# Altium project BMS_Current_Sense.PrjPcb
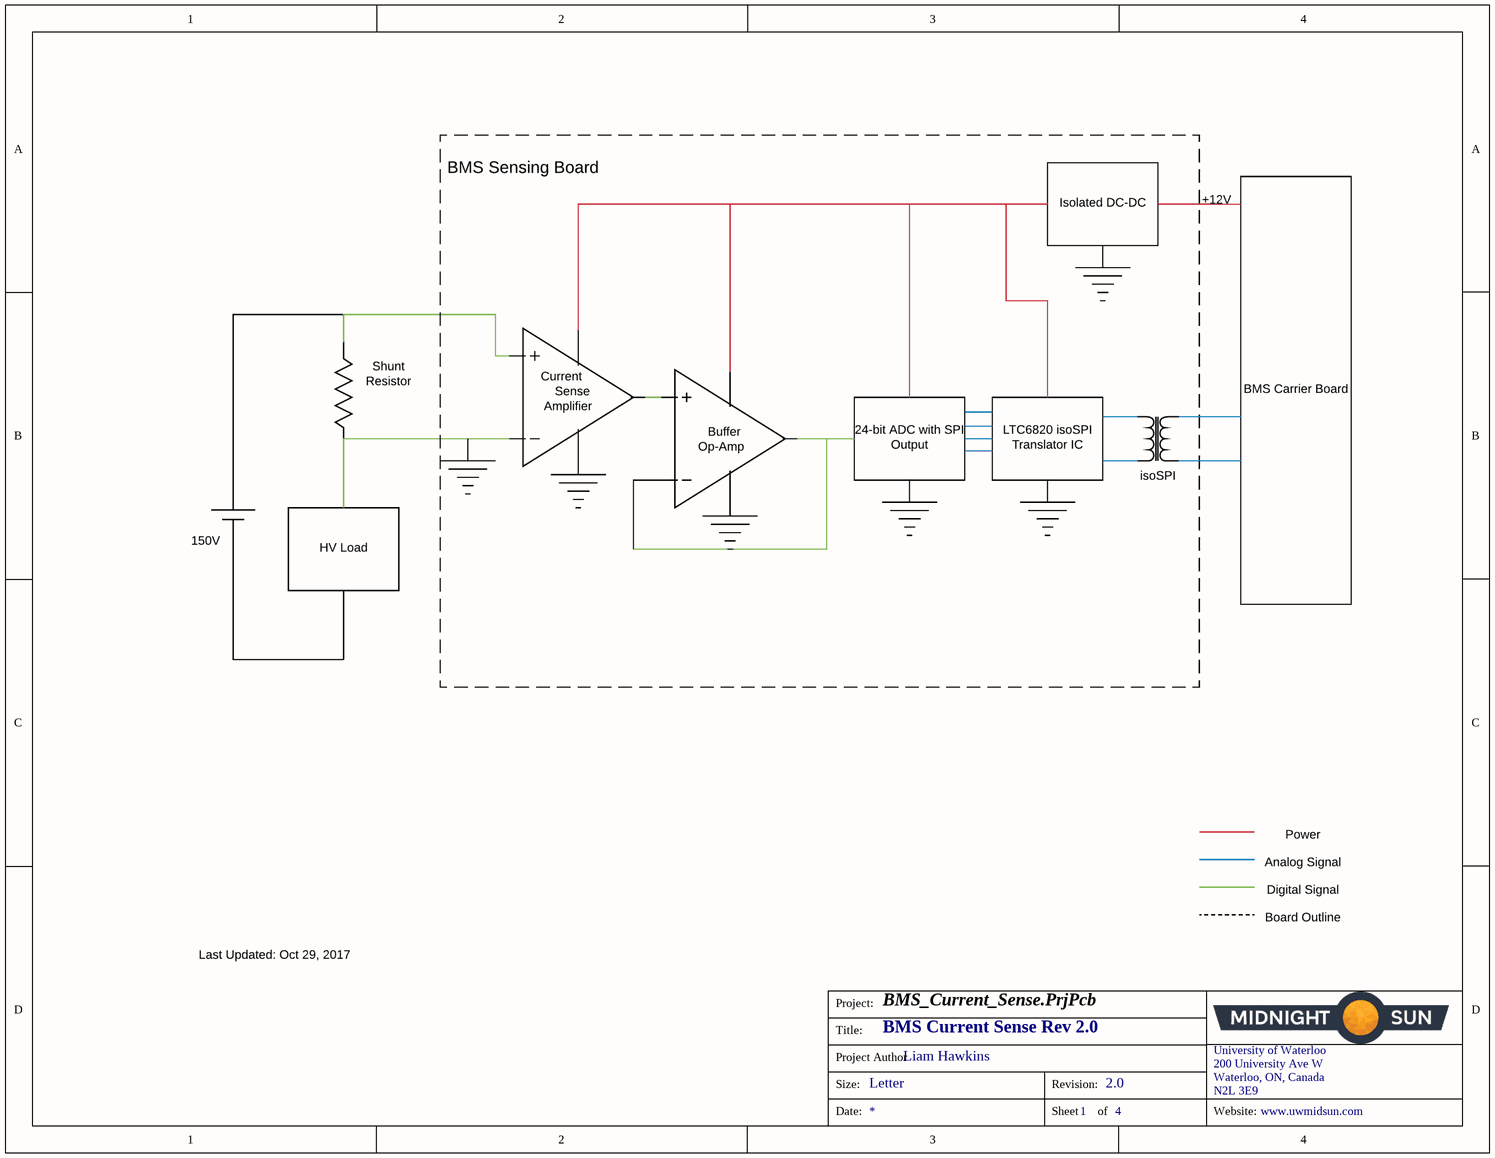
[diagram p0: Block Diagram.SchDoc]
Title: BMS Current Sense Rev 2.0; ProjectRevision: 2.0; ProjectAuthor: Liam Hawkins
4 sheets, 57 parts. Net scope: flat (ports and power ports of the same name join across sheets).
Board file: BMS_Current_Sense.PcbDoc
Sheets:
  Block Diagram.SchDoc
  BMS_Current_Sense.SchDoc
  isoSPI_Interface.SchDoc
  ADC_Circuit.SchDoc

## Sheet Block Diagram.SchDoc: BMS Current Sense Rev 2.0
size Letter; Organization: Midnight Sun Solar Rayce Car Team; Address1: University of Waterloo; Address2: 200 University Ave W; Address3: Waterloo, ON, Canada; Address4: N2L 3E9; DocumentNumber: 1; SheetNumber: 1; SheetTotal: 4; Website: www.uwmidsun.com

### Notes on the sheet
- Project:
- Title:
- Size:
- Project Author
- Letter
- Revision:
- University of Waterloo
- 200 University Ave W
- Waterloo, ON, Canada
- N2L 3E9
- Date:
- Sheet
- of
- Website:

## Sheet BMS_Current_Sense.SchDoc: BMS Current Sense Rev 2.0
size Letter; Organization: Midnight Sun Solar Rayce Car Team; Address1: University of Waterloo; Address2: 200 University Ave W; Address3: Waterloo, ON, Canada; Address4: N2L 3E9; DocumentNumber: 2; SheetNumber: 2; SheetTotal: 4; Website: www.uwmidsun.com
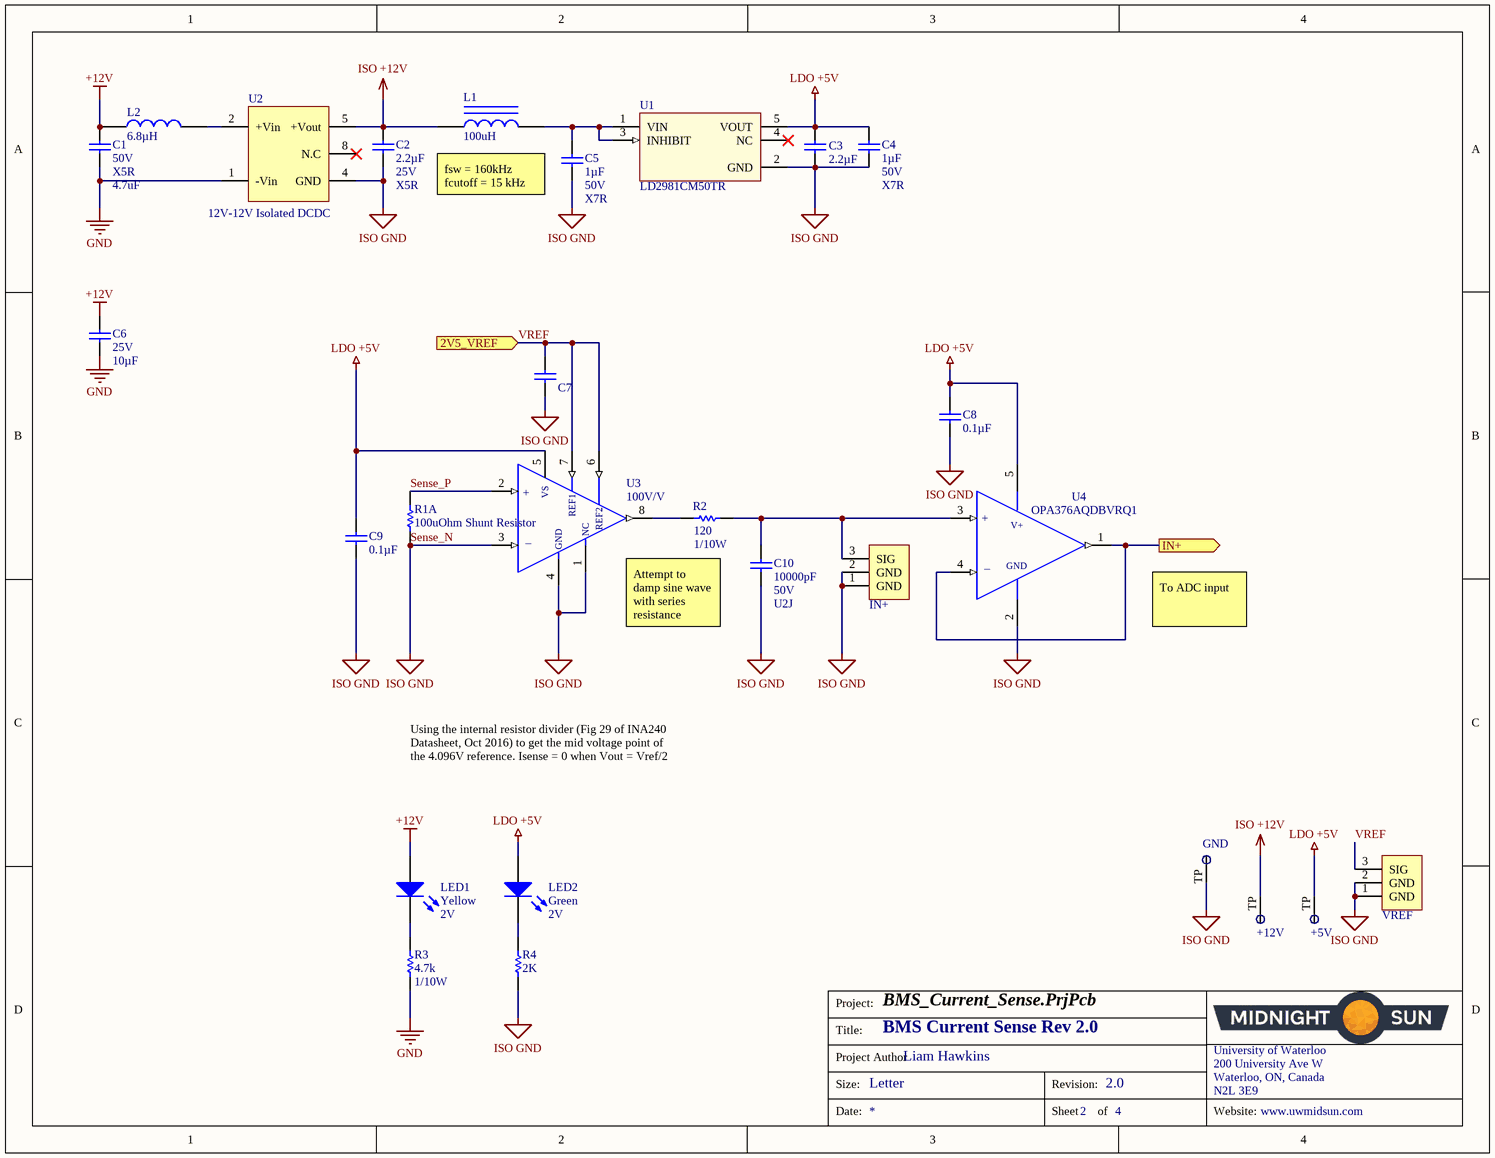
[diagram p1: BMS_Current_Sense.SchDoc]

### Parts
+5V  Test Point  [Test Point]  (value not drawn)  (no BOM)
+12V  Test Point  [Test Point]  (value not drawn)  (no BOM)
C1  value 4.7uF  Voltage - Rated: 50V  Temperature Coefficient: X5R  [CAP, 0805]  (hidden comment: CAP CER 4.7UF 50V 10% X5R 0805)
C2  Capacitance: 2.2µF  Voltage: 25V  Temperature Coefficient: X5R  [CAP, 0603]  (hidden comment: CAP CER 2.2UF 25V 10% X5R 0603)
C3  Capacitance: 2.2µF  [CAP, 0603]  (hidden comment: CAP CER 2.2UF 25V 10% X5R 0603)
C4  Capacitance: 1µF  Voltage: 50V  Temperature Coefficient: X7R  [CAP, 0603]  (hidden comment: CAP CER 1UF 50V 10% X7R 0603)
C5  Capacitance: 1µF  Voltage: 50V  Temperature Coefficient: X7R  [CAP, 0603]  (hidden comment: CAP CER 1UF 50V 10% X7R 0603)
C6  Voltage - Rated: 25V  Capacitance: 10µF  [CAP, 0805]  (hidden comment: CAP CER 10uF 25V 10% X5R 0805)
C7  CAP CER 0.022UF 50V 10% X7R 0603  [CAP, 0603]  (value not drawn)
C8  Capacitance: 0.1µF  [CAP, 0603]  (hidden comment: CAP CER 0.1UF 50V 10% X7R 0603)
C9  Capacitance: 0.1µF  [CAP, 0603]  (hidden comment: CAP CER 0.1UF 50V 10% X7R 0603)
C10  Capacitance: 10000pF  Voltage: 50V  Temperature Coefficient: U2J  [CAP, 0603]  (hidden comment: CAP CER 10nF 50V 5% X7R 0603)
GND  Test Point  [Test Point]  (value not drawn)  (no BOM)
IN+  U.FL-R-SMT-1(01)  [CONN U.FL RCPT STR 50 OHM SMD]  (value not drawn)
L1  value 100uH  [1210]  (hidden comment: IND 100uH 60mA 5% 1210)
L2  Inductance: 6.8µH  [NLFV32T-6R8M-EF/IND 6.8uH]  (hidden comment: IND 6.8uH 260mA 20% 1210)
LED1  Color: Yellow  Voltage - Forward (Vf) (Typ): 2V  [LED_0603]  (hidden comment: LED YELLOW CLEAR 2.1V 0603)
LED2  Color: Green  Voltage - Forward (Vf) (Typ): 2V  [LED_0603]  (hidden comment: LED GREEN CLEAR 2V 0603)
R1  100uOhm Shunt Resistor  [RES SHUNT 100UOHM 60MM]  (part A of 2)
R2  Resistance: 120  Power: 1/10W  [RES, 0603]  (hidden comment: RES 120 OHM 1% 1/10W 0603)
R3  Resistance (Ohms): 4.7k  Power (Watts): 1/10W  [RES, 0603]  (hidden comment: RES 4.7K OHM 1% 1/10W 0603)
R4  2K  [RES, 0603]
U1  Manufacturer Part Number 1: LD2981CM50TR  [SOT95P280X145-5N]  (hidden comment: IC REG LDO 5V 0.1A SOT23-5)
U2  Type: 12V-12V Isolated DCDC  [IC, Isolated DCDC]  (hidden comment: IC DCDC ISOLATED 12V 1W 8-SMD 5-LEAD)
U3  100V/V  [IC CURRENT AMPLIFIER INA240 TSSOP-8]
U4  Manufacturer Part Number: OPA376AQDBVRQ1  [IC OP AMP GP RR 10MHZ SOT-23-5]  (hidden comment: IC OP AMP GEN PURPOSE RR 5.5MHZ SOT-23-5)
VREF  U.FL-R-SMT-1(01)  [CONN U.FL RCPT STR 50 OHM SMD]  (value not drawn)

### Ports
2V5_VREF (in), IN+ (out)

### Nets
+12V: C1.1 C6.1 L2.1 LED1.1(A)
GND: C1.2 C6.2 R3.2 U2.1(-Vin)
ISO +12V: +12V.TP C2.1 L1.1 U2.5(+Vout)
LDO +5V: +5V.TP C3.1 C4.1 C8.1 C9.1 LED2.1(A) U1.5(VOUT) U3.5(VS) U4.5(VDD)
Sense_N: C2.2 C3.2 C4.2 C5.2 C7.2 C8.2 C9.2 C10.2 GND.TP IN+.1(GND) IN+.2(GND) R1.6 R4.2 U1.2(GND) U2.4(GND) U3.1(NC) U3.3(-IN) U3.4(GND) U4.2(VSS) VREF.1(GND) VREF.2(GND)  [also labelled ISO GND]
Sense_P: R1.5 U3.2(+IN)  [project net Sense_P_2]
VREF: C7.1 U3.6(REF2) U3.7(REF1) VREF.3(SIG) ; port 2V5_VREF
NetC5_1: C5.1 L1.2 U1.1(VIN) U1.3(INHIBIT)
NetC10_1: C10.1 IN+.3(SIG) R2.2 U4.3(+IN)
NetL2_2: L2.2 U2.2(+Vin)
NetLED1_2: LED1.2(K) R3.1
NetLED2_2: LED2.2(K) R4.1
NetR2_1: R2.1 U3.8(OUTPUT)
NetR11_1: U4.1(OUTPUT) U4.4(-IN) ; port IN+

Not connected (* = marked no-connect by the designer): U1 4(NC)*; U2 8(N.C)*

### Notes on the sheet
- fsw = 160kHz
  fcutoff = 15 kHz
- (near U3) Attempt to damp sine wave with series resistance
- To ADC input
- Using the internal resistor divider (Fig 29 of INA240 Datasheet, Oct 2016) to get the mid voltage point of the 4.096V reference. Isense = 0 when Vout = Vref/2
- Project:
- Title:
- Size:
- Project Author
- Letter
- Revision:
- University of Waterloo
- 200 University Ave W
- Waterloo, ON, Canada
- N2L 3E9
- Date:
- Sheet
- of
- Website:
- (in symbol IC CURRENT AMPLIFIER INA240 8-TSSOP) +; _
- (in symbol IC OP AMP GEN PURPOSE RR 5.5MHZ SOT-23-5) +; V+; GND; _

### Library data of the parts
C1 = CAP CER 4.7UF 50V 10% X5R 0805: 4.7µF ±20% 50V Ceramic Capacitor X5R 0805 (2012 Metric); Manufacturer 1: Murata Electronics North America; Manufacturer Part Number 1: GRT21BR61H475ME13L; Description 1: CAP CER 4.7UF 50V X5R 0805; Supplier 1: Digi-Key; Supplier Part Number 1: 490-12395-1-ND; RoHS: RoHS Compliant; Category: Capacitors; Stock 1: 4286; Pricing 1: 1=0.56, 10=0.389, 100=0.2338, 500=0.17536, 1000=0.14808 (CAD); Packaging: Cut Tape (CT); Part Status: Active; Tolerance: ±20%; Operating Temperature: -55°C ~ 85°C; Features: -; Ratings: AEC-Q200; Applications: Automotive; Mounting Type: Surface Mount, MLCC; Package / Case: 0805 (2012 Metric); Size / Dimension: 0.079" L x 0.049" W (2.00mm x 1.25mm); Height - Seated (Max): -; Thickness (Max): 0.057" (1.45mm); Lead Spacing: -; Lead Style: -; ComponentLink1URL: http://search.murata.co.jp/Ceramy/image/img/A01X/G101/ENG/GRT21BR61H475ME13-01.pdf; ComponentLink1Description: http://search.murata.co.jp/Ceramy/image/img/A01X/G101/ENG/GRT21BR61H475ME13-01.pdf
C2 C3 = CAP CER 2.2UF 25V 10% X5R 0603: 2.2µF ±10% 25V Ceramic Capacitor X5R 0603 (1608 Metric); Manufacturer 1: Murata Electronics North America; Manufacturer Part Number 1: GRM188R61E225KA12D; Supplier 1: Digi-Key; Supplier Part Number 1: 490-10731-1-ND; Packaging: Cut Tape (CT); Part Status: Active; Operating Temperature: -55°C ~ 85°C; Ratings: -; Mounting Type: Surface Mount, MLCC; Package / Case: 0603 (1608 Metric); Size / Dimension: 0.063" L x 0.031" W (1.60mm x 0.80mm); Height - Seated (Max): -; Thickness (Max): 0.035" (0.90mm); Lead Spacing: -; Lead Style: -; ComponentLink1URL: http://www.murata.com/~/media/webrenewal/support/library/catalog/products/capacitor/mlcc/c02e.ashx; ComponentLink1Description: http://www.murata.com/~/media/webrenewal/support/library/catalog/products/capacitor/mlcc/c02e.ashx; Tolerance: ±10%
  C3: Voltage: 25V; Temperature Coefficient: X5R
C4 C5 = CAP CER 1UF 50V 10% X7R 0603: 1µF ±10% 50V Ceramic Capacitor X7R 0603 (1608 Metric); Manufacturer 1: Taiyo Yuden; Manufacturer Part Number 1: UMK107AB7105KA-T; Supplier 1: Digi-Key; Supplier Part Number 1: 587-3247-1-ND; Packaging: Cut Tape (CT); Part Status: Active; Operating Temperature: -55°C ~ 125°C; Ratings: -; Mounting Type: Surface Mount, MLCC; Package / Case: 0603 (1608 Metric); Size / Dimension: 0.063" L x 0.031" W (1.60mm x 0.80mm); Height - Seated (Max): -; Thickness (Max): 0.037" (0.95mm); Lead Spacing: -; Lead Style: -; ComponentLink1URL: http://www.yuden.co.jp/productdata/catalog/en/mlcc_all_e.pdf; ComponentLink1Description: http://www.yuden.co.jp/productdata/catalog/en/mlcc_all_e.pdf; Tolerance: ±10%
C6 = CAP CER 10uF 25V 10% X5R 0805: 10µF ±10% 25V Ceramic Capacitor X5R 0805 (2012 Metric); Manufacturer: Murata Electronics North America; Manufacturer Part Number: GRM21BR61E106KA73L; Supplier 1: Digi-Key; RoHS: RoHS Compliant; Category: Capacitors; Stock 1: 1695157; Packaging: Cut Tape (CT); Part Status: Active; Tolerance: ±10%; Temperature Coefficient: X5R; Operating Temperature: -55°C ~ 85°C; Features: -; Ratings: -; Applications: General Purpose; Mounting Type: Surface Mount, MLCC; Package / Case: 0805 (2012 Metric); Size / Dimension: 0.079" L x 0.049" W (2.00mm x 1.25mm); Height - Seated (Max): -; Thickness (Max): 0.053" (1.35mm); Lead Spacing: -; Lead Style: -; ComponentLink1URL: http://search.murata.co.jp/Ceramy/image/img/A01X/G101/ENG/GRM21BR61E106KA73-01.pdf; ComponentLink1Description: http://search.murata.co.jp/Ceramy/image/img/A01X/G101/ENG/GRM21BR61E106KA73-01.pdf; Supplier Part Number 1: 490-5523-1-ND; Pricing 1: 1=0.3, 10=0.214, 100=0.1008, 500=0.07068, 1000=0.05851 (CAD)
C7 = CAP CER 0.022UF 50V 10% X7R 0603: 0.022µF ±10% 50V Ceramic Capacitor X7R 0603 (1608 Metric); Manufacturer 1: Murata Electronics North America; Manufacturer Part Number 1: GRM188R71H223KA01D; Description 1: CAP CER 0.022UF 50V X7R 0603; Supplier 1: Digi-Key; Supplier Part Number 1: 490-1517-1-ND; RoHS: RoHS Compliant; Category: Capacitors; Stock 1: 612330; Pricing 1: 1=0.15, 10=0.111, 100=0.0499, 500=0.03564, 1000=0.02801 (CAD); Packaging: Cut Tape (CT); Part Status: Active; Tolerance: ±10%; Voltage - Rated: 50V; Temperature Coefficient: X7R; Operating Temperature: -55°C ~ 125°C; Features: -; Ratings: -; Applications: General Purpose; Mounting Type: Surface Mount, MLCC; Package / Case: 0603 (1608 Metric); Size / Dimension: 0.063" L x 0.032" W (1.60mm x 0.80mm); Height - Seated (Max): -; Thickness (Max): 0.035" (0.90mm); Lead Spacing: -; Lead Style: -; ComponentLink1URL: http://search.murata.co.jp/Ceramy/image/img/A01X/G101/ENG/GRM188R71H223KA01-01.pdf; ComponentLink1Description: http://search.murata.co.jp/Ceramy/image/img/A01X/G101/ENG/GRM188R71H223KA01-01.pdf
C8 C9 = CAP CER 0.1UF 50V 10% X7R 0603: 0.10µF ±10% 50V Ceramic Capacitor X7R 0603 (1608 Metric); Manufacturer 1: AVX Corporation; Manufacturer Part Number 1: 06035C104KAT2A; Supplier 1: Digi-Key; Supplier Part Number 1: 478-5052-1-ND; Packaging: Cut Tape (CT); Part Status: Active; Operating Temperature: -55°C ~ 125°C; Ratings: -; Mounting Type: Surface Mount, MLCC; Package / Case: 0603 (1608 Metric); Size / Dimension: 0.063" L x 0.032" W (1.60mm x 0.81mm); Height - Seated (Max): -; Thickness (Max): 0.035" (0.90mm); Lead Spacing: -; Lead Style: -; ComponentLink1URL: http://datasheets.avx.com/X7RDielectric.pdf; ComponentLink1Description: http://datasheets.avx.com/X7RDielectric.pdf; Tolerance: ±10%; Voltage: 50V; Temperature Coefficient: X7R
C10 = CAP CER 10nF 50V 5% X7R 0603: 10000pF ±5% 50V Ceramic Capacitor U2J 0603 (1608 Metric); Manufacturer 1: KEMET; Manufacturer Part Number 1: C0603C103J5JAC7867; Supplier 1: Digi-Key; Supplier Part Number 1: 399-13384-1-ND; Packaging: Cut Tape (CT); Part Status: Active; Operating Temperature: -55°C ~ 125°C; Ratings: -; Failure Rate: -; Mounting Type: Surface Mount, MLCC; Package / Case: 0603 (1608 Metric); Size / Dimension: 0.063" L x 0.032" W (1.60mm x 0.80mm); Height - Seated (Max): -; Thickness (Max): 0.034" (0.87mm); Lead Spacing: -; Lead Style: -; ComponentLink1URL: http://www.kemet.com/docfinder?Partnumber=C0603C103J5JAC7867; ComponentLink1Description: http://www.kemet.com/docfinder?Partnumber=C0603C103J5JAC7867; Tolerance: ±5%
IN+ VREF = CONN U.FL RCPT STR 50 OHM SMD: U.FL (UMCC) Connector Receptacle, Male Pin 50Ohm Surface Mount Solder; Manufacturer: Hirose; Body Material: Bronze; Body Plating: Silver; Dielectric Material: Polymer; Max Frequency: 6GHz; Connector Type: Male Pin,Receptacle; Impedance: 50R; Supplier 1: Digi-Key; Manufacturer Part Number: U.FL-R-SMT-1(01); RoHS: Yes; Category: RF / Coaxial Connectors; Stock 1: 1274; Pricing 1: 1=1.28000, 10=1.12200, 25=1.05600, 50=1.01200, 100=0.96800, 250=0.88000, 500=0.79200, 1000=0.70400, 2500=0.63800 (USD); Mount: Surface Mount; Housing Color: Silver; Contact Plating: Gold; Contact Material: Bronze,Brass; Min Operating Temperature: -40°C; Max Operating Temperature: 90°C; Termination: Solder; Orientation: Vertical; Package Quantity: 100; Packaging: Bulk; Fastening Type: Snap; Length: 3.1mm; Depth: 3mm; Radiation Hardening: No; Lead Free: Lead Free; ComponentLink1URL: https://datasheet.ciiva.com/26945/getdatasheetpartid-475239-26945414.pdf?src-supplier=Verical; ComponentLink1Description: https://datasheet.ciiva.com/26945/getdatasheetpartid-475239-26945414.pdf?src-supplier=Verical; Supplier Part Number 1: H122041-ND
L1 = IND 100uH 60mA 5% 1210: 100µH Unshielded Wirewound Inductor 60mA 11 Ohm Max 1210 (3225 Metric); Manufacturer: EPCOS (TDK); Manufacturer Part Number: B82422T1104J000; Material - Core: Ferrite; Q @ Freq: 20 @ 796kHz; Supplier 1: Digi-Key; RoHS: RoHS Compliant; Category: Inductors, Coils, Chokes; Stock 1: 4846; Pricing 1: 1=0.65, 10=0.568, 100=0.4062, 500=0.3412, 1000=0.27621 (CAD); Packaging: Cut Tape (CT); Part Status: Active; Type: Wirewound; Tolerance: ±5%; Shielding: Unshielded; DC Resistance (DCR): 11 Ohm Max; Ratings: AEC-Q200; Operating Temperature: -55°C ~ 125°C; Mounting Type: Surface Mount; Package / Case: 1210 (3225 Metric); Supplier Device Package: 1210 (3225 Metric); Size / Dimension: 0.126" L x 0.098" W (3.20mm x 2.50mm); Height - Seated (Max): 0.083" (2.10mm); ComponentLink1URL: https://en.tdk.eu/inf/30/db/ind_2008/b82422t.pdf; ComponentLink1Description: https://en.tdk.eu/inf/30/db/ind_2008/b82422t.pdf; Supplier Part Number 1: 495-5646-1-ND
L2 = IND 6.8uH 260mA 20% 1210: 6.8µH Shielded Wirewound Inductor 260mA 204 mOhm Max 1210 (3225 Metric); Manufacturer 1: TDK Corporation; Manufacturer Part Number 1: NLFV32T-6R8M-EF; Material - Core: Ferrite; Supplier 1: Digi-Key; Supplier Part Number 1: 445-15776-1-ND; Packaging: Cut Tape (CT); Part Status: Active; Type: Wirewound; Current Rating: 260mA; Current - Saturation: -; Shielding: Shielded; DC Resistance (DCR): 204 mOhm Max; Q @ Freq: -; Frequency - Self Resonant: -; Ratings: -; Operating Temperature: -40°C ~ 105°C; Mounting Type: Surface Mount; Package / Case: 1210 (3225 Metric); Supplier Device Package: 1210 (3225 Metric); Size / Dimension: 0.126" L x 0.098" W (3.20mm x 2.50mm); Height - Seated (Max): 0.094" (2.40mm); ComponentLink1URL: https://product.tdk.com/info/en/catalog/datasheets/inductor_commercial_decoupling_nlfv32-ef_en.pdf; ComponentLink1Description: https://product.tdk.com/info/en/catalog/datasheets/inductor_commercial_decoupling_nlfv32-ef_en.pdf; Tolerance: ±20%
LED1 = LED YELLOW CLEAR 2.1V 0603: Yellow 590nm LED Indication - Discrete 2V 0603 (1608 Metric); Manufacturer: Wurth Electronics Inc.; Manufacturer Part Number: 150060YS75000; Lens Color: Colorless; Millicandela Rating: 120mcd; Lens Style/Size: Rectangle with Flat Top, 1.10mm x 0.70mm; Current - Test: 20mA; Viewing Angle: 140°; Wavelength - Peak: 595nm; Supplier 1: Digi-Key; RoHS: RoHS Compliant; Category: Optoelectronics; Stock 1: 10523; Pricing 1: 1=0.21, 100=0.1617, 500=0.13964 (CAD); Packaging: Cut Tape (CT); Part Status: Active; Lens Transparency: Clear; Mounting Type: Surface Mount; Wavelength - Dominant: 590nm; Features: -; Package / Case: 0603 (1608 Metric); Supplier Device Package: 0603; Size / Dimension: 1.60mm L x 0.80mm W; Height (Max): 0.80mm; ComponentLink1URL: http://katalog.we-online.de/led/datasheet/150060YS75000.pdf; ComponentLink1Description: http://katalog.we-online.de/led/datasheet/150060YS75000.pdf; Supplier Part Number 1: 732-4981-1-ND
LED2 = LED GREEN CLEAR 2V 0603: Green 572nm LED Indication - Discrete 2V 0603 (1608 Metric); Manufacturer: Wurth Electronics Inc.; Manufacturer Part Number: 150060VS75000; Lens Color: Colorless; Millicandela Rating: 40mcd; Lens Style/Size: Rectangle with Flat Top, 1.10mm x 0.70mm; Current - Test: 20mA; Viewing Angle: 140°; Wavelength - Dominant: 570nm; Supplier 1: Digi-Key; RoHS: RoHS Compliant; Category: Optoelectronics; Stock 1: 9408; Pricing 1: 1=0.21, 100=0.1617, 500=0.13964 (CAD); Packaging: Cut Tape (CT); Part Status: Active; Lens Transparency: Clear; Mounting Type: Surface Mount; Wavelength - Peak: 572nm; Features: -; Package / Case: 0603 (1608 Metric); Supplier Device Package: 0603; Size / Dimension: 1.60mm L x 0.80mm W; Height (Max): 0.80mm; ComponentLink1URL: http://katalog.we-online.de/led/datasheet/150060VS75000.pdf; ComponentLink1Description: http://katalog.we-online.de/led/datasheet/150060VS75000.pdf; Supplier Part Number 1: 732-4980-1-ND
R1 = RES SHUNT 100UOHM 5% 36W 60MM: 100 µOhms ±5% 36W Shunt, Battery Specialized Resistor Metal Element ±175ppm/°C Shunt Fixture, 60mm Pitch; Manufacturer 1: Vishay Dale; Manufacturer Part Number 1: WSBM8518L1000JK; Supplier 1: Digi-Key; Supplier Part Number 1: 541-1906-ND; RoHS: RoHS Compliant; Description 1: RES SHUNT 100 UOHM 5% 36W; Category: Resistors; Stock 1: 0; Pricing 1: 1=16.24, 10=14.764, 25=13.2876, 50=11.442, 100=10.5192, 250=9.9656, 500=9.5965, 1000=9.15359 (CAD); Packaging: Bulk; Part Status: Active; Type: Shunt, Battery; Applications: -; Composition: Metal Element; Tolerance: ±5%; Power (Watts): 36W; Temperature Coefficient: ±175ppm/°C; Operating Temperature: -65°C ~ 170°C; Mounting Type: Shunt Fixture, 60mm Pitch; ComponentLink1URL: http://www.vishay.com/docs/31094/wsbm8518.pdf; ComponentLink1Description: http://www.vishay.com/docs/31094/wsbm8518.pdf
R2 = RES 120 OHM 1% 1/10W 0603: RES SMD 120 OHM 1% 1/10W 0603; Manufacturer 1: Yageo; Manufacturer Part Number 1: RC0603FR-07120RL; Temperature Coefficient: ±100ppm/°C; Supplier 1: Digi-Key; Supplier Part Number 1: 311-120HRCT-ND; Packaging: Cut Tape (CT); Part Status: Active; Composition: Thick Film; Operating Temperature: -55°C ~ 155°C; Package / Case: 0603 (1608 Metric); Supplier Device Package: 0603; Size / Dimension: 0.063" L x 0.031" W (1.60mm x 0.80mm); Height - Seated (Max): 0.022" (0.55mm); Failure Rate: -; ComponentLink1URL: http://www.yageo.com/documents/recent/PYu-RC_Group_51_RoHS_L_7.pdf; ComponentLink1Description: http://www.yageo.com/documents/recent/PYu-RC_Group_51_RoHS_L_7.pdf; Tolerance: ±1%
R3 = RES 4.7K OHM 1% 1/10W 0603: 4.7k Ohm ±1% 0.1W, 1/10W Chip Resistor 0603 (1608 Metric) Moisture Resistant Thick Film; Manufacturer 1: Yageo; Manufacturer Part Number 1: RC0603FR-074K7L; Description 1: RES SMD 4.7K OHM 1% 1/10W 0603; Temperature Coefficient: ±100ppm/°C; Supplier 1: Digi-Key; Supplier Part Number 1: 311-4.70KHRCT-ND; RoHS: RoHS Compliant; Category: Resistors; Stock 1: 3487566; Pricing 1: 1=0.16, 10=0.022, 100=0.0089, 1000=0.00402, 2500=0.00349 (CAD); Packaging: Cut Tape (CT); Part Status: Active; Composition: Thick Film; Features: Moisture Resistant; Operating Temperature: -55°C ~ 155°C; Package / Case: 0603 (1608 Metric); Supplier Device Package: 0603; Size / Dimension: 0.063" L x 0.031" W (1.60mm x 0.80mm); Height - Seated (Max): 0.022" (0.55mm); Failure Rate: -; ComponentLink1URL: http://www.yageo.com/documents/recent/PYu-RC_Group_51_RoHS_L_7.pdf; ComponentLink1Description: http://www.yageo.com/documents/recent/PYu-RC_Group_51_RoHS_L_7.pdf; Tolerance: ±1%
R4 = RES 2K OHM 1% 1/10W 0603: 2k Ohm ±1% 0.1W, 1/10W Chip Resistor 0603 (1608 Metric) Moisture Resistant Thick Film; Manufacturer: Yageo; Manufacturer Part Number: RC0603FR-072KL; Temperature Coefficient: ±100ppm/°C; Supplier 1: Digi-Key; RoHS: RoHS Compliant; Category: Resistors; Stock 1: 1750701; Pricing 1: 1=0.15, 10=0.023, 100=0.0093, 1000=0.00415, 2500=0.0036 (CAD); Packaging: Cut Tape (CT); Part Status: Active; Resistance (Ohms): 2k; Tolerance: ±1%; Power (Watts): 0.1W, 1/10W; Composition: Thick Film; Features: Moisture Resistant; Operating Temperature: -55°C ~ 155°C; Package / Case: 0603 (1608 Metric); Supplier Device Package: 0603; Size / Dimension: 0.063" L x 0.031" W (1.60mm x 0.80mm); Height - Seated (Max): 0.022" (0.55mm); Failure Rate: -; ComponentLink1URL: http://www.yageo.com/documents/recent/PYu-RC_Group_51_RoHS_L_7.pdf; ComponentLink1Description: http://www.yageo.com/documents/recent/PYu-RC_Group_51_RoHS_L_7.pdf; Supplier Part Number 1: 311-2.00KHRCT-ND
U1 = IC REG LDO 5V 0.1A SOT23-5: Linear Voltage Regulator IC Positive Fixed Output 5V 100mA SOT-23-5; Manufacturer 1: STMicroelectronics; Voltage - Dropout (Typical): 0.18V @ 100mA; Voltage - Input: Up to 16V; Supplier 1: Digi-Key; Supplier Part Number 1: 497-7787-1-ND; Packaging: Cut Tape (CT); Part Status: Active; Regulator Topology: Positive Fixed; Voltage - Output: 5V; Current - Output: 100mA; Current - Limit (Min): -; Operating Temperature: -40°C ~ 125°C; Mounting Type: Surface Mount; Package / Case: SC-74A, SOT-753; Supplier Device Package: SOT-23-5; ComponentLink1URL: http://www.st.com/content/ccc/resource/technical/document/datasheet/group1/b7/b5/a1/83/9c/bd/4a/90/CD00001635/files/CD00001635.pdf/jcr:content/translations/en.CD00001635.pdf; ComponentLink1Description: http://www.st.com/content/ccc/resource/technical/document/datasheet/group1/b7/b5/a1/83/9c/bd/4a/90/CD00001635/files/CD00001635.pdf/jcr:content/translations/en.CD00001635.pdf
U2 = IC DCDC ISOLATED 12V 1W 8-SMD 5-LEAD: Isolated Module DC DC Converter 1 Output 12V 84mA 10.8V - 13.2V Input; Manufacturer 1: XP Power; Manufacturer Part Number 1: ISE1212A; Number of Outputs: 1; Voltage - Isolation: 1.5kV (1500V); Efficiency: 81%; Supplier 1: Digi-Key; Supplier Part Number 1: 1470-2950-1-ND; Packaging: Cut Tape (CT); Part Status: Active; Voltage - Input (Min): 10.8V; Voltage - Input (Max): 13.2V; Voltage - Output 1: 12V; Voltage - Output 2: -; Voltage - Output 3: -; Current - Output (Max): 84mA; Operating Temperature: -40°C ~ 105°C; Mounting Type: Surface Mount; Package / Case: 8-SMD Module, 5 Leads; Size / Dimension: 0.50" L x 0.44" W x 0.29" H (12.7mm x 11.2mm x 7.3mm); ComponentLink1URL: http://www.xppower.com/Portals/0/pdfs/SF_ISE.pdf; ComponentLink1Description: http://www.xppower.com/Portals/0/pdfs/SF_ISE.pdf; Power: 1W
U3 = IC CURRENT AMPLIFIER INA240 8-TSSOP: Current Sense Amplifier 1 Circuit 8-TSSOP; Manufacturer 1: Texas Instruments; Manufacturer Part Number 1: INA240A3PWR; Description 1: IC AMP CURRENT SENSE 8-TSSOP; Slew Rate: 2 V/µs; Current - Supply: 1.8mA; Voltage - Supply, Single/Dual (±): 2.7 V ~ 5.5 V; Supplier 1: Digi-Key; Supplier Part Number 1: 296-45090-1-ND; RoHS: RoHS Compliant; Category: Integrated Circuits (ICs); Stock 1: 1286; Pricing 1: 1=3.79, 10=3.397, 100=2.7311, 500=2.24388, 1000=1.85921 (CAD); Packaging: Cut Tape (CT); Part Status: Active; Amplifier Type: Current Sense; Output Type: -; Operating Temperature: -40°C ~ 125°C; Mounting Type: Surface Mount; Package / Case: 8-TSSOP (0.173", 4.40mm Width); Supplier Device Package: 8-TSSOP; ComponentLink1URL: http://www.ti.com/lit/ds/symlink/ina240.pdf; ComponentLink1Description: http://www.ti.com/lit/ds/symlink/ina240.pdf
U4 = IC OP AMP GEN PURPOSE RR 5.5MHZ SOT-23-5: General Purpose Amplifier 1 Circuit Rail-to-Rail SOT-23-5; Manufacturer: Texas Instruments; Max Supply Voltage: 5.5V; Min Supply Voltage: 2.2V; Output Current: 30mA; Nominal Supply Current: 950uA; Voltage Gain: 134dB; Common Mode Rejection Ratio: 76dB; Number of Channels: 1; Slew Rate: 2V/µs; Max I/O Voltage: 25uV; Input Bias Current: 10pA; Operating Supply Current: 760uA; Output Current per Channel: 50mA; Power Supply Rejection Ratio (PSRR): 106.02dB; Supplier 1: Digi-Key; Stock 1: 26635; Pricing 1: 1 = 2.14000, 10 = 1.92200, 100 = 1.54450, 500 = 1.26896, 1000 = 1.05142 (USD); RoHS: Yes; Case/Package: SOT-23-5; Number of Pins: 5; Min Operating Temperature: -40°C; Max Operating Temperature: 125°C; Unity Gain Bandwidth Product: 5.5MHz; Packaging: Tape and Reel; Package Quantity: 3000; Number of Circuits: 1; Gain Bandwidth Product: 5.5MHz; Input Offset Voltage (Vos): 25uV; Number of Elements: 1; Radiation Hardening: No; Lead Free: Lead Free; ComponentLink1URL: http://www.ti.com/lit/ds/sbos549/sbos549.pdf?src-supplier=Avnet; ComponentLink1Description: http://www.ti.com/lit/ds/sbos549/sbos549.pdf?src-supplier=Avnet; Supplier Part Number 1: 296-36701-1-ND

## Sheet isoSPI_Interface.SchDoc: BMS Current Sense Rev 2.0
size Letter; Organization: Midnight Sun Solar Rayce Car Team; Address1: University of Waterloo; Address2: 200 University Ave W; Address3: Waterloo, ON, Canada; Address4: N2L 3E9; DocumentNumber: 3; SheetNumber: 3; SheetTotal: 4; Website: www.uwmidsun.com
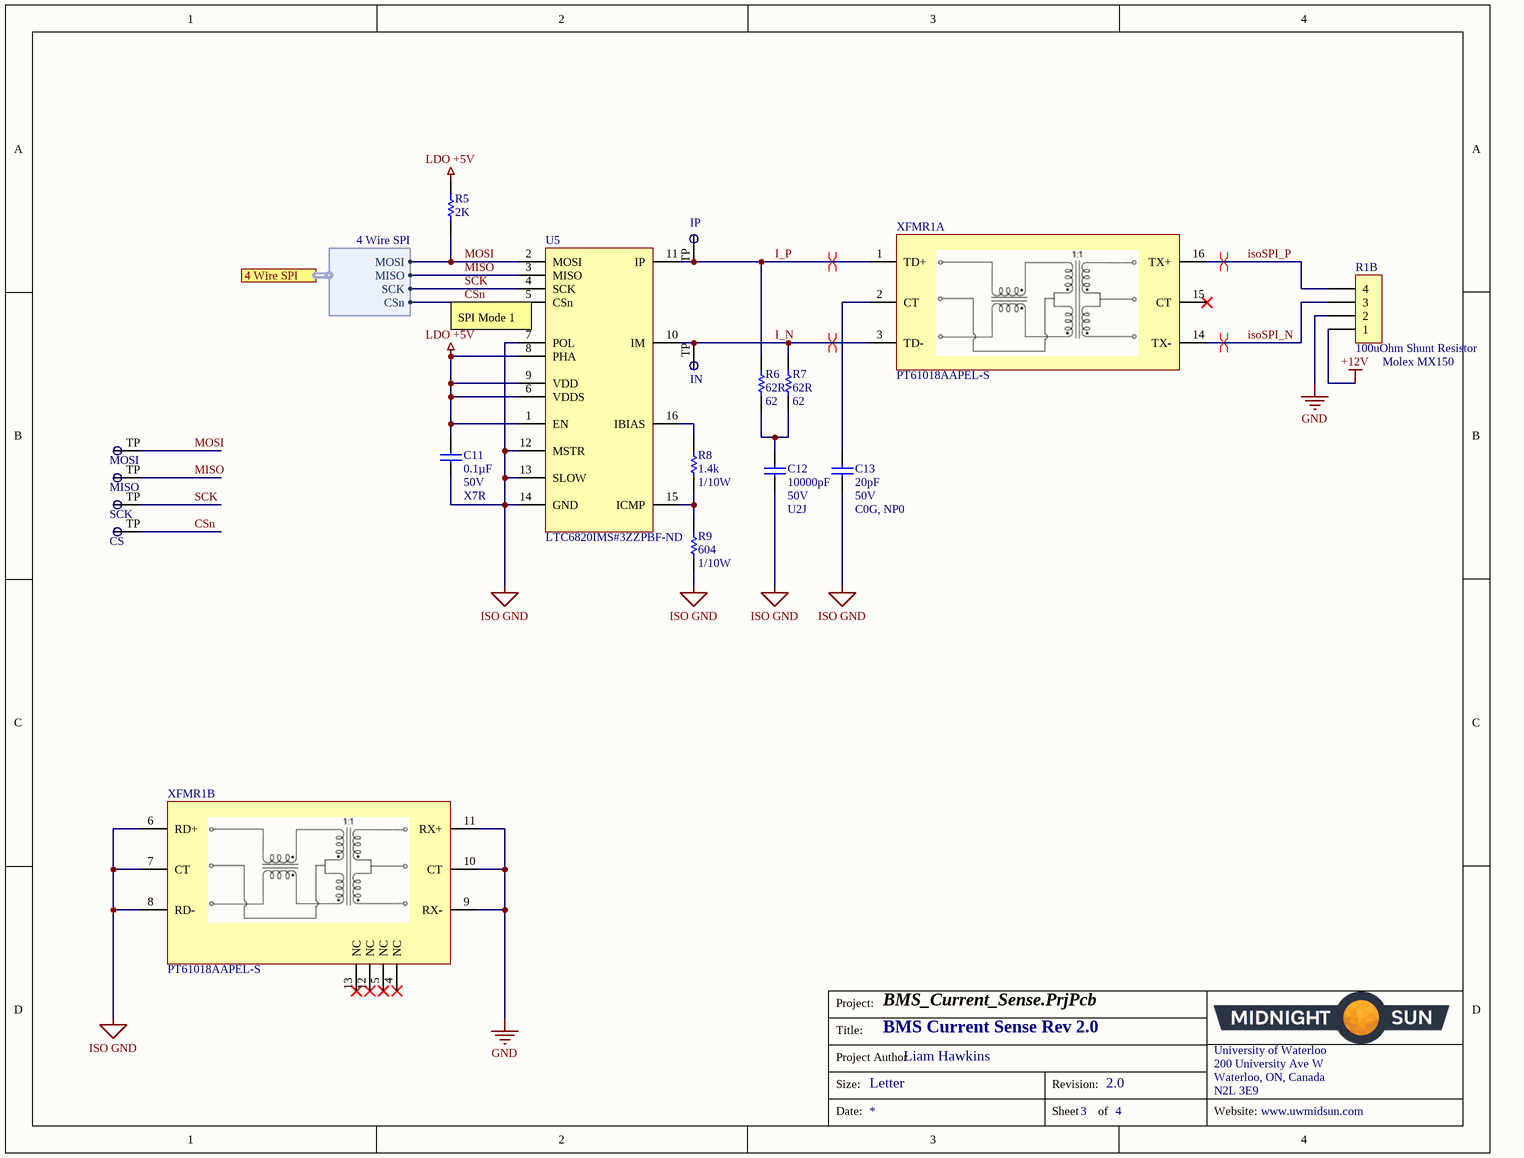
[diagram p2: isoSPI_Interface.SchDoc]

### Parts
C11  Capacitance: 0.1µF  Voltage: 50V  Temperature Coefficient: X7R  [CAP, 0603]  (hidden comment: CAP CER 0.1UF 50V 10% X7R 0603)
C12  Capacitance: 10000pF  Voltage: 50V  Temperature Coefficient: U2J  [CAP, 0603]  (hidden comment: CAP CER 10nF 50V 5% X7R 0603)
C13  Capacitance: 20pF  Voltage: 50V  Temperature Coefficient: C0G, NP0  [CAP, 0603]  (hidden comment: CAP CER 20PF 50V ±5% C0G/NP0 0603)
CS  Test Point  [Test Point]  (value not drawn)  (no BOM)
IN  Test Point  [Test Point]  (value not drawn)  (no BOM)
IP  Test Point  [Test Point]  (value not drawn)  (no BOM)
MISO  Test Point  [Test Point]  (value not drawn)  (no BOM)
MOSI  Test Point  [Test Point]  (value not drawn)  (no BOM)
R1  100uOhm Shunt Resistor  [RES SHUNT 100UOHM 60MM]  (part B of 2)
R5  2K  [RES, 0603]
R6  62R  value 62  [RES, 0603]
R7  62R  value 62  [RES, 0603]
R8  Resistance: 1.4k  Power: 1/10W  [RES, 0603]  (hidden comment: RES 1.4k OHM 1% 1/10W 0603)
R9  Resistance: 604  Power: 1/10W  [RES, 0603]  (hidden comment: RES 604 OHM 1% 1/10W 0603)
SCK  Test Point  [Test Point]  (value not drawn)  (no BOM)
U5  Supplier Part Number 1: LTC6820IMS#3ZZPBF-ND  [IC isoSPI Interface LTC6820 MSOP]  (hidden comment: IC ISOSPI COMM INTERFACE LTC6820IMS#3ZZPBF)
XFMR1  MFG_PN: PT61018AAPEL-S  [IC, PULSE XFMR 1CT:1CT 350UH SMD]  (hidden comment: IC PULSE XFMR 1CT:1CT 350UH SMD)  (parts A,B of 2)

### Ports
4 Wire SPI (harness 4 Wire SPI)

### Harnesses
4 Wire SPI: MOSI, MISO, SCK, CSn

### Nets
+12V: R1.1
GND: R1.2 XFMR1.9(RX-) XFMR1.10(CT) XFMR1.11(RX+)
ISO GND: C11.2 C12.2 C13.2 R9.2 U5.7(POL) U5.12(MSTR) U5.13(SLOW) U5.14(GND) XFMR1.6(RD+) XFMR1.7(CT) XFMR1.8(RD-)  [project net Sense_N]
LDO +5V: C11.1 R5.1 U5.1(EN) U5.6(VDDS) U5.8(PHA) U5.9(VDD)
CSn: CS.TP U5.5(CSn) ; port 4 Wire SPI.CSn
I_N: IN.TP R7.1 U5.10(IM) XFMR1.3(TD-)  [project net I_N_3]
I_P: IP.TP R6.1 U5.11(IP) XFMR1.1(TD+)  [project net I_P_3]
isoSPI_N: R1.3 XFMR1.14(TX-)  [project net isoSPI_N_3]
isoSPI_P: R1.4 XFMR1.16(TX+)  [project net isoSPI_P_3]
MISO: MISO.TP U5.3(MISO) ; port 4 Wire SPI.MISO
MOSI: MOSI.TP R5.2 U5.2(MOSI) ; port 4 Wire SPI.MOSI
SCK: SCK.TP U5.4(SCK) ; port 4 Wire SPI.SCK
NetC12_1: C12.1 R6.2 R7.2
NetC13_1: C13.1 XFMR1.2(CT)
NetR8_1: R8.1 U5.16(IBIAS)
NetR8_2: R8.2 R9.1 U5.15(ICMP)

Not connected (* = marked no-connect by the designer): XFMR1 4(NC)* 5(NC)* 12(NC)* 13(NC)* 15(CT)*

### Layout directives
differential pair: I_N_3, I_P_3, isoSPI_N_3, isoSPI_P_3

### Notes on the sheet
- (near U5) SPI Mode 1
- (near R1) Molex MX150
- Project:
- Title:
- Size:
- Project Author
- Letter
- Revision:
- University of Waterloo
- 200 University Ave W
- Waterloo, ON, Canada
- N2L 3E9
- Date:
- Sheet
- of
- Website:

### Library data of the parts
C11 = CAP CER 0.1UF 50V 10% X7R 0603: as C8 on sheet BMS_Current_Sense; Supplier 1: Digi-Key; Supplier Part Number 1: 478-5052-1-ND; Packaging: Cut Tape (CT); Part Status: Active; Operating Temperature: -55°C ~ 125°C; Ratings: -; Mounting Type: Surface Mount, MLCC; Package / Case: 0603 (1608 Metric); Size / Dimension: 0.063" L x 0.032" W (1.60mm x 0.81mm); Height - Seated (Max): -; Thickness (Max): 0.035" (0.90mm); Lead Spacing: -; Lead Style: -; ComponentLink1URL: http://datasheets.avx.com/X7RDielectric.pdf; ComponentLink1Description: http://datasheets.avx.com/X7RDielectric.pdf; Tolerance: ±10%
C12 = CAP CER 10nF 50V 5% X7R 0603: as C10 on sheet BMS_Current_Sense; Supplier 1: Digi-Key; Supplier Part Number 1: 399-13384-1-ND; Packaging: Cut Tape (CT); Part Status: Active; Operating Temperature: -55°C ~ 125°C; Ratings: -; Failure Rate: -; Mounting Type: Surface Mount, MLCC; Package / Case: 0603 (1608 Metric); Size / Dimension: 0.063" L x 0.032" W (1.60mm x 0.80mm); Height - Seated (Max): -; Thickness (Max): 0.034" (0.87mm); Lead Spacing: -; Lead Style: -; ComponentLink1URL: http://www.kemet.com/docfinder?Partnumber=C0603C103J5JAC7867; ComponentLink1Description: http://www.kemet.com/docfinder?Partnumber=C0603C103J5JAC7867; Tolerance: ±5%
C13 = CAP CER 20PF 50V ±5% C0G/NP0 0603: 20pF ±5% 50V Ceramic Capacitor C0G, NP0 0603 (1608 Metric); Manufacturer 1: Murata Electronics North America; Manufacturer Part Number 1: GRM1885C1H200JA01D; Supplier 1: Digi-Key; Supplier Part Number 1: 490-1410-1-ND; Packaging: Cut Tape (CT); Part Status: Active; Operating Temperature: -55°C ~ 125°C; Ratings: -; Mounting Type: Surface Mount, MLCC; Package / Case: 0603 (1608 Metric); Size / Dimension: 0.063" L x 0.031" W (1.60mm x 0.80mm); Height - Seated (Max): -; Thickness (Max): 0.035" (0.90mm); Lead Spacing: -; Lead Style: -; ComponentLink1URL: http://www.murata.com/~/media/webrenewal/support/library/catalog/products/capacitor/mlcc/c02e.ashx; ComponentLink1Description: http://www.murata.com/~/media/webrenewal/support/library/catalog/products/capacitor/mlcc/c02e.ashx; Tolerance: ±5%
R1 = RES SHUNT 100UOHM 5% 36W 60MM: as R1 on sheet BMS_Current_Sense; Supplier 1: Digi-Key; Supplier Part Number 1: 541-1906-ND; RoHS: RoHS Compliant; Description 1: RES SHUNT 100 UOHM 5% 36W; Category: Resistors; Stock 1: 0; Pricing 1: 1=16.24, 10=14.764, 25=13.2876, 50=11.442, 100=10.5192, 250=9.9656, 500=9.5965, 1000=9.15359 (CAD); Packaging: Bulk; Part Status: Active; Type: Shunt, Battery; Applications: -; Composition: Metal Element; Tolerance: ±5%; Power (Watts): 36W; Temperature Coefficient: ±175ppm/°C; Operating Temperature: -65°C ~ 170°C; Mounting Type: Shunt Fixture, 60mm Pitch; ComponentLink1URL: http://www.vishay.com/docs/31094/wsbm8518.pdf; ComponentLink1Description: http://www.vishay.com/docs/31094/wsbm8518.pdf
R5 = RES 2K OHM 1% 1/10W 0603: as R4 on sheet BMS_Current_Sense; Supplier 1: Digi-Key; RoHS: RoHS Compliant; Category: Resistors; Stock 1: 1750701; Pricing 1: 1=0.15, 10=0.023, 100=0.0093, 1000=0.00415, 2500=0.0036 (CAD); Packaging: Cut Tape (CT); Part Status: Active; Resistance (Ohms): 2k; Tolerance: ±1%; Power (Watts): 0.1W, 1/10W; Composition: Thick Film; Features: Moisture Resistant; Operating Temperature: -55°C ~ 155°C; Package / Case: 0603 (1608 Metric); Supplier Device Package: 0603; Size / Dimension: 0.063" L x 0.031" W (1.60mm x 0.80mm); Height - Seated (Max): 0.022" (0.55mm); Failure Rate: -; ComponentLink1URL: http://www.yageo.com/documents/recent/PYu-RC_Group_51_RoHS_L_7.pdf; ComponentLink1Description: http://www.yageo.com/documents/recent/PYu-RC_Group_51_RoHS_L_7.pdf; Supplier Part Number 1: 311-2.00KHRCT-ND
R6 R7 = RES 62 OHM 0.1% 1/10W 0603: 62 Ohms ±0.1% 0.1W, 1/10W Chip Resistor 0603 (1608 Metric) Automotive AEC-Q200 Thin Film; Manufacturer: Panasonic Electronic Components; Manufacturer Part Number: ERA-3AEB620V; Temperature Coefficient: ±25ppm/°C; Supplier 1: Digi-Key; RoHS: RoHS Compliant; Category: Resistors; Stock 1: 10320; Pricing 1: 1=0.52, 10=0.447, 100=0.1748, 1000=0.07317, 2500=0.06708 (CAD); Packaging: Cut Tape (CT); Part Status: Active; Tolerance: ±0.1%; Power (Watts): 0.1W, 1/10W; Composition: Thin Film; Features: Automotive AEC-Q200; Operating Temperature: -55°C ~ 155°C; Package / Case: 0603 (1608 Metric); Supplier Device Package: 0603; Size / Dimension: 0.063" L x 0.032" W (1.60mm x 0.80mm); Height - Seated (Max): 0.022" (0.55mm); Failure Rate: -; ComponentLink1URL: https://industrial.panasonic.com/cdbs/www-data/pdf/RDM0000/AOA0000C307.pdf; ComponentLink1Description: https://industrial.panasonic.com/cdbs/www-data/pdf/RDM0000/AOA0000C307.pdf; Supplier Part Number 1: P62DBCT-ND
R8 = RES 1.4k OHM 1% 1/10W 0603: RES SMD 1.4K OHM 1% 1/10W 0603; Manufacturer 1: Yageo; Manufacturer Part Number 1: RC0603FR-071K4L; Temperature Coefficient: ±100ppm/°C; Supplier 1: Digi-Key; Supplier Part Number 1: 311-1.40KHRCT-ND; Packaging: Cut Tape (CT); Part Status: Active; Composition: Thick Film; Operating Temperature: -55°C ~ 155°C; Package / Case: 0603 (1608 Metric); Supplier Device Package: 0603; Size / Dimension: 0.063" L x 0.031" W (1.60mm x 0.80mm); Height - Seated (Max): 0.022" (0.55mm); Failure Rate: -; ComponentLink1URL: http://www.yageo.com/documents/recent/PYu-RC_Group_51_RoHS_L_7.pdf; ComponentLink1Description: http://www.yageo.com/documents/recent/PYu-RC_Group_51_RoHS_L_7.pdf; Tolerance: ±1%
R9 = RES 604 OHM 1% 1/10W 0603: RES SMD 604 OHM 1% 1/10W 0603; Manufacturer 1: Yageo; Manufacturer Part Number 1: RC0603FR-07604RL; Temperature Coefficient: ±100ppm/°C; Supplier 1: Digi-Key; Supplier Part Number 1: 311-604HRCT-ND; Packaging: Cut Tape (CT); Part Status: Active; Composition: Thick Film; Operating Temperature: -55°C ~ 155°C; Package / Case: 0603 (1608 Metric); Supplier Device Package: 0603; Size / Dimension: 0.063" L x 0.031" W (1.60mm x 0.80mm); Height - Seated (Max): 0.022" (0.55mm); Failure Rate: -; ComponentLink1URL: http://www.yageo.com/documents/recent/PYu-RC_Group_51_RoHS_L_7.pdf; ComponentLink1Description: http://www.yageo.com/documents/recent/PYu-RC_Group_51_RoHS_L_7.pdf; Tolerance: ±1%
U5 = IC ISOSPI COMM INTERFACE LTC6820IMS#3ZZPBF: Isolated Communications Interface Interface 16-MSOP; Manufacturer: Linear Technology; Interface: SPI; Voltage - Supply: 2.7 V ~ 5.5 V; Manufacturer Part Number: LTC6820IMS#3ZZPBF; RoHS: RoHS3 Compliant; Category: Integrated Circuits (ICs); Packaging: Tube; Part Status: Active; Applications: Isolated Communications Interface; Package / Case: 16-TFSOP (0.118", 3.00mm Width); Supplier Device Package: 16-MSOP; Mounting Type: Surface Mount; ComponentLink1URL: http://www.linear.com/docs/42317; ComponentLink1Description: http://www.linear.com/docs/42317; Supplier 1: Digi-Key
XFMR1 = IC PULSE XFMR 1CT:1CT 350UH SMD: PULSE XFMR 1CT:1CT 350UH SMD; Manufacturer: Bourns Inc.; Isolation Voltage: 1.5kVrms; Supplier: Digikey; Supplier_PN: PT61018AAPEL-SCT-ND; Inductance: 350uH; Supplier 1: Digi-Key; Supplier Part Number 1: PT61018AAPEL-SCT-ND

## Sheet ADC_Circuit.SchDoc: BMS Current Sense Rev 2.0
size Letter; Organization: Midnight Sun Solar Rayce Car Team; Address1: University of Waterloo; Address2: 200 University Ave W; Address3: Waterloo, ON, Canada; Address4: N2L 3E9; DocumentNumber: 4; SheetNumber: 4; SheetTotal: 4; Website: www.uwmidsun.com
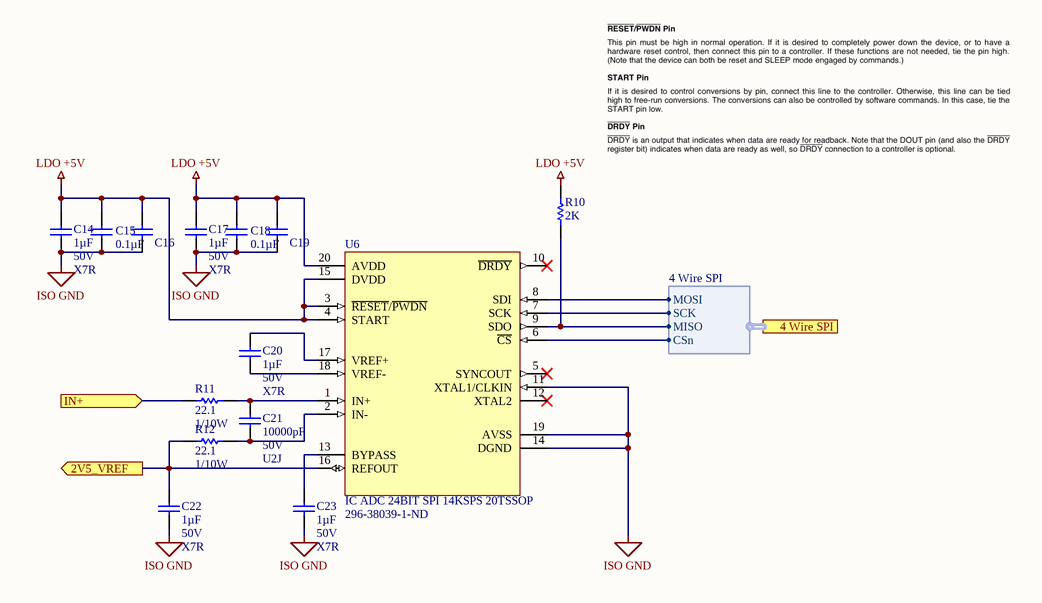
[diagram p3: ADC_Circuit.SchDoc]

### Parts
C14  Capacitance: 1µF  Voltage: 50V  Temperature Coefficient: X7R  [CAP, 0603]  (hidden comment: CAP CER 1UF 50V 10% X7R 0603)
C15  Capacitance: 0.1µF  [CAP, 0603]  (hidden comment: CAP CER 0.1UF 50V 10% X7R 0603)
C16  CAP CER 0.022UF 50V 10% X7R 0603  [CAP, 0603]  (value not drawn)
C17  Capacitance: 1µF  Voltage: 50V  Temperature Coefficient: X7R  [CAP, 0603]  (hidden comment: CAP CER 1UF 50V 10% X7R 0603)
C18  Capacitance: 0.1µF  [CAP, 0603]  (hidden comment: CAP CER 0.1UF 50V 10% X7R 0603)
C19  CAP CER 0.022UF 50V 10% X7R 0603  [CAP, 0603]  (value not drawn)
C20  Capacitance: 1µF  Voltage: 50V  Temperature Coefficient: X7R  [CAP, 0603]  (hidden comment: CAP CER 1UF 50V 10% X7R 0603)
C21  Capacitance: 10000pF  Voltage: 50V  Temperature Coefficient: U2J  [CAP, 0603]  (hidden comment: CAP CER 10nF 50V 5% X7R 0603)
C22  Capacitance: 1µF  Voltage: 50V  Temperature Coefficient: X7R  [CAP, 0603]  (hidden comment: CAP CER 1UF 50V 10% X7R 0603)
C23  Capacitance: 1µF  Voltage: 50V  Temperature Coefficient: X7R  [CAP, 0603]  (hidden comment: CAP CER 1UF 50V 10% X7R 0603)
R10  2K  [RES, 0603]
R11  Resistance: 22.1  Power: 1/10W  [RES, 0603]  (hidden comment: RES 22.1 OHM 1% 1/10W 0603)
R12  Resistance: 22.1  Power: 1/10W  [RES, 0603]  (hidden comment: RES 22.1 OHM 1% 1/10W 0603)
U6  IC ADC 24BIT SPI 14KSPS 20TSSOP  Supplier Part Number 1: 296-38039-1-ND  [TSSOP65P640X120-20N]

### Ports
2V5_VREF (out), 4 Wire SPI (harness 4 Wire SPI), IN+ (in)

### Harnesses
4 Wire SPI: MOSI, MISO, SCK, CSn

### Nets
ISO GND: C14.2 C15.2 C16.2 C17.2 C18.2 C19.2 C22.2 C23.2 U6.11(XTAL1/CLKIN) U6.14(DGND) U6.19(AVSS)  [project net Sense_N]
LDO +5V: C14.1 C15.1 C16.1 C17.1 C18.1 C19.1 R10.1 U6.3(~{RE}~{SET}/~{PW}~{DN}) U6.4(START) U6.15(DVDD) U6.20(AVDD)
CSn: U6.6(~{C}~{S}) ; port 4 Wire SPI.CSn
MISO: R10.2 U6.9(SDO) ; port 4 Wire SPI.MISO
MOSI: U6.8(SDI) ; port 4 Wire SPI.MOSI
SCK: U6.7(SCK) ; port 4 Wire SPI.SCK
VREF: C22.1 R12.1 U6.16(REFOUT) ; port 2V5_VREF
NetC20_1: C20.1 U6.17(VREF+)
NetC20_2: C20.2 U6.18(VREF-)
NetC21_1: C21.1 R11.2 U6.1(IN+)
NetC21_2: C21.2 R12.2 U6.2(IN-)
NetC23_1: C23.1 U6.13(BYPASS)
NetR11_1: R11.1 ; port IN+

Not connected (* = marked no-connect by the designer): U6 5(SYNCOUT)* 10(~{DRD}~{Y})* 12(XTAL2)*

### Notes on the sheet
- Project:
- Title:
- Size:
- Project Author
- Letter
- Revision:
- University of Waterloo
- 200 University Ave W
- Waterloo, ON, Canada
- N2L 3E9
- Date:
- Sheet
- of
- Website:

### Library data of the parts
C14 C17 C20 C22 C23 = CAP CER 1UF 50V 10% X7R 0603: as C4 on sheet BMS_Current_Sense; Supplier 1: Digi-Key; Supplier Part Number 1: 587-3247-1-ND; Packaging: Cut Tape (CT); Part Status: Active; Operating Temperature: -55°C ~ 125°C; Ratings: -; Mounting Type: Surface Mount, MLCC; Package / Case: 0603 (1608 Metric); Size / Dimension: 0.063" L x 0.031" W (1.60mm x 0.80mm); Height - Seated (Max): -; Thickness (Max): 0.037" (0.95mm); Lead Spacing: -; Lead Style: -; ComponentLink1URL: http://www.yuden.co.jp/productdata/catalog/en/mlcc_all_e.pdf; ComponentLink1Description: http://www.yuden.co.jp/productdata/catalog/en/mlcc_all_e.pdf; Tolerance: ±10%
C15 C18 = CAP CER 0.1UF 50V 10% X7R 0603: as C8 on sheet BMS_Current_Sense; Supplier 1: Digi-Key; Supplier Part Number 1: 478-5052-1-ND; Packaging: Cut Tape (CT); Part Status: Active; Operating Temperature: -55°C ~ 125°C; Ratings: -; Mounting Type: Surface Mount, MLCC; Package / Case: 0603 (1608 Metric); Size / Dimension: 0.063" L x 0.032" W (1.60mm x 0.81mm); Height - Seated (Max): -; Thickness (Max): 0.035" (0.90mm); Lead Spacing: -; Lead Style: -; ComponentLink1URL: http://datasheets.avx.com/X7RDielectric.pdf; ComponentLink1Description: http://datasheets.avx.com/X7RDielectric.pdf; Tolerance: ±10%; Voltage: 50V; Temperature Coefficient: X7R
C16 C19 = CAP CER 0.022UF 50V 10% X7R 0603: as C7 on sheet BMS_Current_Sense; Supplier 1: Digi-Key; Supplier Part Number 1: 490-1517-1-ND; RoHS: RoHS Compliant; Category: Capacitors; Stock 1: 612330; Pricing 1: 1=0.15, 10=0.111, 100=0.0499, 500=0.03564, 1000=0.02801 (CAD); Packaging: Cut Tape (CT); Part Status: Active; Tolerance: ±10%; Voltage - Rated: 50V; Temperature Coefficient: X7R; Operating Temperature: -55°C ~ 125°C; Features: -; Ratings: -; Applications: General Purpose; Mounting Type: Surface Mount, MLCC; Package / Case: 0603 (1608 Metric); Size / Dimension: 0.063" L x 0.032" W (1.60mm x 0.80mm); Height - Seated (Max): -; Thickness (Max): 0.035" (0.90mm); Lead Spacing: -; Lead Style: -; ComponentLink1URL: http://search.murata.co.jp/Ceramy/image/img/A01X/G101/ENG/GRM188R71H223KA01-01.pdf; ComponentLink1Description: http://search.murata.co.jp/Ceramy/image/img/A01X/G101/ENG/GRM188R71H223KA01-01.pdf
C21 = CAP CER 10nF 50V 5% X7R 0603: as C10 on sheet BMS_Current_Sense; Supplier 1: Digi-Key; Supplier Part Number 1: 399-13384-1-ND; Packaging: Cut Tape (CT); Part Status: Active; Operating Temperature: -55°C ~ 125°C; Ratings: -; Failure Rate: -; Mounting Type: Surface Mount, MLCC; Package / Case: 0603 (1608 Metric); Size / Dimension: 0.063" L x 0.032" W (1.60mm x 0.80mm); Height - Seated (Max): -; Thickness (Max): 0.034" (0.87mm); Lead Spacing: -; Lead Style: -; ComponentLink1URL: http://www.kemet.com/docfinder?Partnumber=C0603C103J5JAC7867; ComponentLink1Description: http://www.kemet.com/docfinder?Partnumber=C0603C103J5JAC7867; Tolerance: ±5%
R10 = RES 2K OHM 1% 1/10W 0603: as R4 on sheet BMS_Current_Sense; Supplier 1: Digi-Key; RoHS: RoHS Compliant; Category: Resistors; Stock 1: 1750701; Pricing 1: 1=0.15, 10=0.023, 100=0.0093, 1000=0.00415, 2500=0.0036 (CAD); Packaging: Cut Tape (CT); Part Status: Active; Resistance (Ohms): 2k; Tolerance: ±1%; Power (Watts): 0.1W, 1/10W; Composition: Thick Film; Features: Moisture Resistant; Operating Temperature: -55°C ~ 155°C; Package / Case: 0603 (1608 Metric); Supplier Device Package: 0603; Size / Dimension: 0.063" L x 0.031" W (1.60mm x 0.80mm); Height - Seated (Max): 0.022" (0.55mm); Failure Rate: -; ComponentLink1URL: http://www.yageo.com/documents/recent/PYu-RC_Group_51_RoHS_L_7.pdf; ComponentLink1Description: http://www.yageo.com/documents/recent/PYu-RC_Group_51_RoHS_L_7.pdf; Supplier Part Number 1: 311-2.00KHRCT-ND
R11 R12 = RES 22.1 OHM 1% 1/10W 0603: 22.1 Ohm ±1% 0.1W, 1/10W Chip Resistor 0603 (1608 Metric) Moisture Resistant Thick Film; Manufacturer 1: Yageo; Manufacturer Part Number 1: RC0603FR-0722R1L; Temperature Coefficient: ±100ppm/°C; Supplier 1: Digi-Key; Supplier Part Number 1: 311-22.1HRCT-ND; Packaging: Cut Tape (CT); Part Status: Active; Composition: Thick Film; Operating Temperature: -55°C ~ 155°C; Package / Case: 0603 (1608 Metric); Supplier Device Package: 0603; Size / Dimension: 0.063" L x 0.031" W (1.60mm x 0.80mm); Height - Seated (Max): 0.022" (0.55mm); Failure Rate: -; ComponentLink1URL: http://www.yageo.com/documents/recent/PYu-RC_Group_51_RoHS_L_7.pdf; ComponentLink1Description: http://www.yageo.com/documents/recent/PYu-RC_Group_51_RoHS_L_7.pdf; Tolerance: ±1%
U6 = IC ADC 24BIT SPI 14KSPS 20TSSOP: 24 Bit Analog to Digital Converter 1 Input 1 Sigma-Delta 20-TSSOP; Manufacturer: Texas Instruments; Manufacturer Part Number: ADS1259QPWRQ1; Categories: Integrated Circuits (ICs); Input Type: Differential, Single Ended; Number of A/D Converters: 1; Number of Bits: 24; Reference Type: External; Sampling Rate (Per Second): 14k; Voltage - Supply, Analog: 5V; Voltage - Supply, Digital: 2.7V ~ 5.25V; Supplier 1: Digi-Key; ComponentLink1Description: Datasheet; ComponentLink1URL: http://www.ti.com/lit/ds/symlink/ads1259.pdf; Architecture: Sigma-Delta; Configuration: ADC; Data Interface: SPI; Features: PGA; Lead Free Status / RoHS Status: Lead free / ROHS3 Compliant; Mounting Type: Surface Mount; Number of Inputs: 1; Operating Temperature: -40°C ~ 105°C; Package / Case: 20-TSSOP (0.173", 4.40mm Width); Packaging: Cut Tape (CT); Part Status: Active; Supplier Device Package: 20-TSSOP

## Nets that join several sheets
+12V: BMS_Current_Sense (C1.1 C6.1 L2.1 LED1.1), isoSPI_Interface (R1.1)
GND: BMS_Current_Sense (C1.2 C6.2 R3.2 U2.1), isoSPI_Interface (R1.2 XFMR1.9 XFMR1.10 XFMR1.11)
LDO +5V: BMS_Current_Sense (9 pins), isoSPI_Interface (6 pins), ADC_Circuit (11 pins)
Sense_N: BMS_Current_Sense (21 pins), isoSPI_Interface (11 pins), ADC_Circuit (11 pins)
CSn: isoSPI_Interface (CS.TP U5.5), ADC_Circuit (U6.6)
MISO: isoSPI_Interface (MISO.TP U5.3), ADC_Circuit (R10.2 U6.9)
MOSI: isoSPI_Interface (MOSI.TP R5.2 U5.2), ADC_Circuit (U6.8)
NetR11_1: BMS_Current_Sense (U4.1 U4.4), ADC_Circuit (R11.1)
SCK: isoSPI_Interface (SCK.TP U5.4), ADC_Circuit (U6.7)
VREF: BMS_Current_Sense (C7.1 U3.6 U3.7 VREF.3), ADC_Circuit (C22.1 R12.1 U6.16)